# EAGLE design gridsEX (EAGLE 6.6.0)
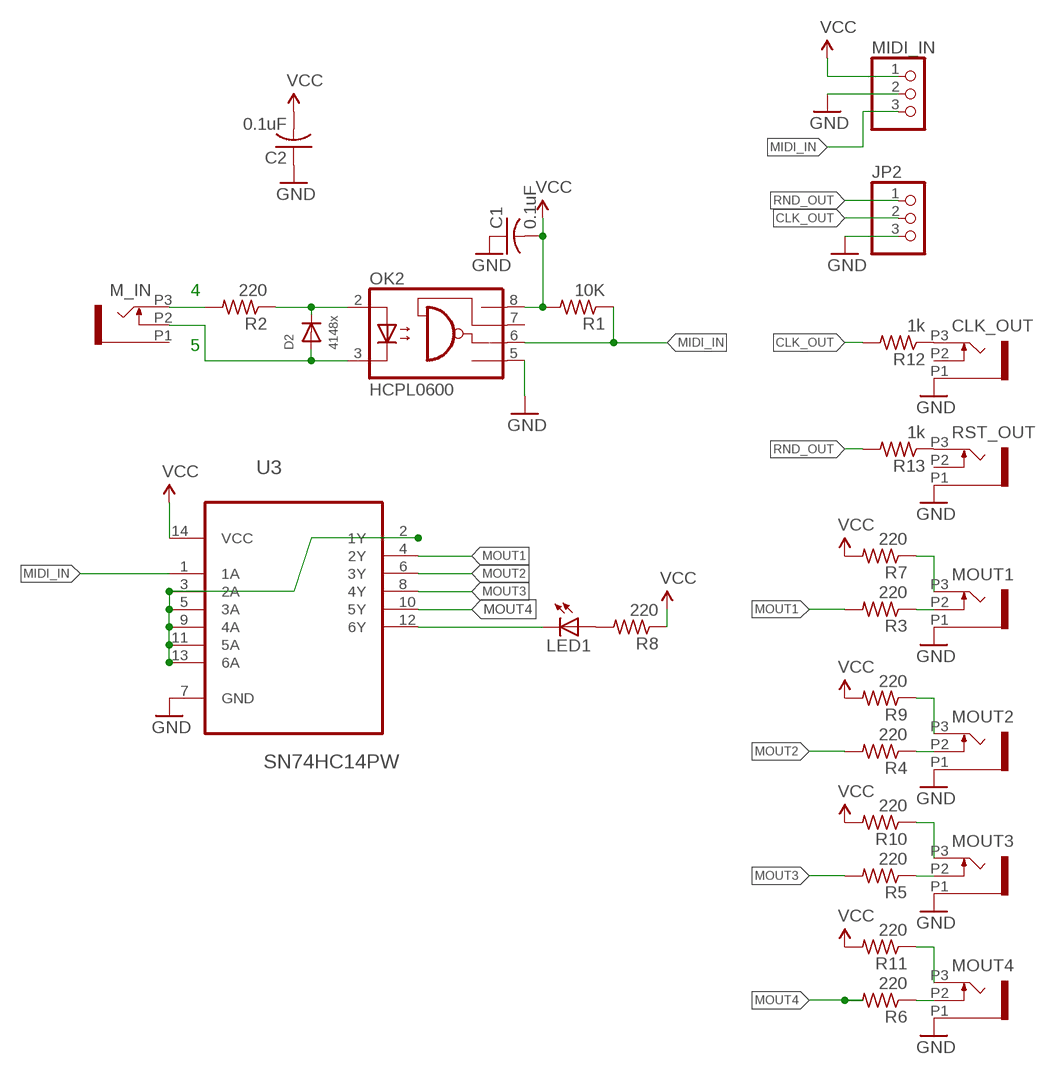
[diagram p0: schematic, sheet 1]

## Parts
C1  0.1uF  RCL_C-USC0603K  [RCL_C0603K]
C2  0.1uF  RCL_C-USC0603K  [RCL_C0603K]
CLK_OUT  PJ301_GUI6  [OG-PJ301_VARIATIONS_WQP_PJ_301M6]
D2  4148x  DIODE_SOD-123  [SOD-123]
JP2  PINHD-1X3  [1X03]
LED1  LED3MM  [LED3MM]
M_IN  PJ301_GUI6  [OG-PJ301_VARIATIONS_WQP_PJ_301M6]
MIDI_IN  PINHD-1X3  [1X03]
MOUT1  PJ301_GUI6  [OG-PJ301_VARIATIONS_WQP_PJ_301M6]
MOUT2  PJ301_GUI6  [OG-PJ301_VARIATIONS_WQP_PJ_301M6]
MOUT3  PJ301_GUI6  [OG-PJ301_VARIATIONS_WQP_PJ_301M6]
MOUT4  PJ301_GUI6  [OG-PJ301_VARIATIONS_WQP_PJ_301M6]
OK2  HCPL0600  [SOIC08]
R1  10K  RCL_R-US_R0603  [RCL_R0603]
R2  220  RCL_R-US_R0603  [RCL_R0603]
R3  220  RCL_R-US_R0603  [RCL_R0603]
R4  220  RCL_R-US_R0603  [RCL_R0603]
R5  220  RCL_R-US_R0603  [RCL_R0603]
R6  220  RCL_R-US_R0603  [RCL_R0603]
R7  220  RCL_R-US_R0603  [RCL_R0603]
R8  220  RCL_R-US_R0603  [RCL_R0603]
R9  220  RCL_R-US_R0603  [RCL_R0603]
R10  220  RCL_R-US_R0603  [RCL_R0603]
R11  220  RCL_R-US_R0603  [RCL_R0603]
R12  1k  RCL_R-US_R0603  [RCL_R0603]
R13  1k  RCL_R-US_R0603  [RCL_R0603]
RST_OUT  PJ301_GUI6  [OG-PJ301_VARIATIONS_WQP_PJ_301M6]
U3  SN74HC14PW  [SOP65P640X120-14N]

## Nets
CLK_OUT: JP2.2 R12.2
GND: C1.1 C2.1 CLK_OUT.P1 JP2.3 MIDI_IN.2 MOUT1.P1 MOUT2.P1 MOUT3.P1 MOUT4.P1 OK2.5(GND) RST_OUT.P1 U3.7(GND)
MIDI_IN: MIDI_IN.3 OK2.6(VO) R1.1 U3.1(1A)
MOUT1: R3.2 U3.4(2Y)
MOUT2: R4.2 U3.6(3Y)
MOUT3: R5.2 U3.8(4Y)
MOUT4: R6.2 U3.10(5Y)
N$1: LED1.K(C) U3.12(6Y)
N$2: D2.C OK2.2(A) R2.1
N$3: M_IN.P3 R2.2
N$4: D2.A M_IN.P2 OK2.3(C)
N$5: LED1.A R8.2
N$6: U3.2(1Y) U3.3(2A) U3.5(3A) U3.9(4A) U3.11(5A) U3.13(6A)
N$7: MOUT1.P2 R3.1
N$8: MOUT1.P3 R7.1
N$9: MOUT2.P3 R9.1
N$10: MOUT3.P3 R10.1
N$11: MOUT4.P3 R11.1
N$12: MOUT2.P2 R4.1
N$13: MOUT3.P2 R5.1
N$14: MOUT4.P2 R6.1
N$15: CLK_OUT.P3 R12.1
N$16: R13.1 RST_OUT.P3
RND_OUT: JP2.1 R13.2
VCC: C1.2 C2.2 MIDI_IN.1 OK2.8(VCC) R1.2 R7.2 R8.1 R9.2 R10.2 R11.2 U3.14(VCC)
Unconnected: CLK_OUT.P2 M_IN.P1 OK2.7(VE) RST_OUT.P2

## Notes on the sheet
- 4
- 5

## Library data of the parts
C1 C2 = ioboard:RCL_C-US: CAPACITOR, American symbol
CLK_OUT M_IN MOUT1-MOUT4 RST_OUT = MILibuTides5:PJ301_GUI
D2 = OldModernDeviceBackup:DIODE: Diode SMADIODE - SMA Surface Mount Package 20V 1A Schottky Diode Digikey: 641-1014-6-ND DO-1N4148 - Through Hole Small Current Diode SOD-123 20V 1 A (.5mV Vf) Schottky Diode - Digikey: MBRX120TPMSCT-ND SOD-323 10V 570mA (.38mV Vf, 3ns) Schottky Diode - Digikey: ZLLS410CT-ND SOD-523 30V 30mA Schottky Diode (RB751S-40TE61) - Digikey: RB751S-40TE61CT-ND SOT23-R/W - SOT23 Package (R = Solder Paste/Reflow Ovens, W = Hand-Soldering) BAT54Film 40V 300mA - Digikey: 497-7162-1-ND DO-214AC DO-214AC 400V 1A Fast Recovery - Digikey: RS1GFSCT-ND MELF-34 4148 style diode - Digikey:FDLL4148CT-ND
JP2 MIDI_IN = pinhead:PINHD-1X3: PIN HEADER
LED1 = led:LED: LED OSRAM: - CHIPLED LG R971, LG N971, LY N971, LG Q971, LY Q971, LO R971, LY R971 LH N974, LH R974 LS Q976, LO Q976, LY Q976 LO Q996 - Hyper CHIPLED LW Q18S LB Q993, LB Q99A, LB R99A - SideLED LS A670, LO A670, LY A670, LG A670, LP A670 LB A673, LV A673, LT A673, LW A673 LH A674 LY A675 LS A676, LA A676, LO A676, LY A676, LW A676 LS A679, LY A679, LG A679 - Hyper Micro SIDELED® LS Y876, LA Y876, LO Y876, LY Y876 LT Y87S - SmartLED LW L88C, LW L88S LB L89C, LB L89S, LG L890 LS L89K, LO L89K, LY L89K LS L896, LA L896, LO L896, LY L896 - TOPLED LS T670, LO T670, LY T670, LG T670, LP T670 LSG T670, LSP T670, LSY T670, LOP T670, LYG T670 LG T671, LOG T671, LSG T671 LB T673, LV T673, LT T673, LW T673 LH T674 LS T676, LA T676, LO T676, LY T676, LB T676, LH T676, LSB T676, LW T676 LB T67C, LV T67C, LT T67C, LS T67K, LO T67K, LY T67K, LW E67C LS E67B, LA E67B, LO E67B, LY E67B, LB E67C, LV E67C, LT E67C LW T67C LS T679, LY T679, LG T679 LS T770, LO T770, LY T770, LG T770, LP T770 LB T773, LV T773, LT T773, LW T773 LH T774 LS E675, LA E675, LY E675, LS T675 LS T776, LA T776, LO T776, LY T776, LB T776 LHGB T686 LT T68C, LB T68C - Hyper Mini TOPLED® LB M676 - Mini TOPLED Santana® LG M470 LS M47K, LO M47K, LY M47K Source: http://www.osram.convergy.de LUXEON: - LUMILED® LXK2-PW12-R00, LXK2-PW12-S00, LXK2-PW14-U00, LXK2-PW14-V00 LXK2-PM12-R00, LXK2-PM12-S00, LXK2-PM14-U00 LXK2-PE12-Q00, LXK2-PE12-R00, LXK2-PE12-S00, LXK2-PE14-T00, LXK2-PE14-U00 LXK2-PB12-K00, LXK2-PB12-L00, LXK2-PB12-M00, LXK2-PB14-N00, LXK2-PB14-P00, LXK2-PB14-Q00 LXK2-PR12-L00, LXK2-PR12-M00, LXK2-PR14-Q00, LXK2-PR14-R00 LXK2-PD12-Q00, LXK2-PD12-R00, LXK2-PD12-S00 LXK2-PH12-R00, LXK2-PH12-S00 LXK2-PL12-P00, LXK2-PL12-Q00, LXK2-PL12-R00 Source: www.luxeon.com KINGBRIGHT: KA-3528ASYC Source: www.kingbright.com
OK2 = optocoupler-2:HCPL0600: HEWLETT PACKARD OPTO COUPLER
R1-R13 = warps_v30:RCL_R-US_: RESISTOR, American symbol
U3 = Raph's Lib:SN74HC14PW: HEX SCHMITT-TRIGGER INVERTERS; MPN: SN74HC14PW; OC_FARNELL: 9591133; OC_NEWARK: 02H5414; PACKAGE: TSSOP-14; SUPPLIER: Texas Instruments

## Board
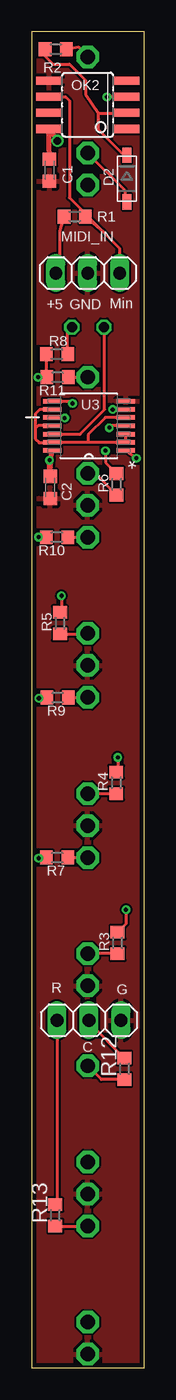
[diagram p1: board, top side]
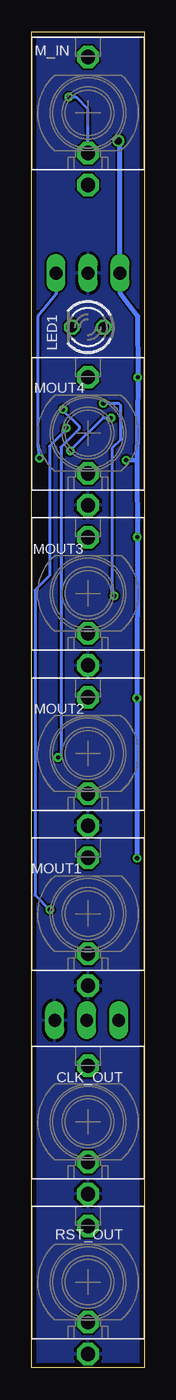
[diagram p2: board, bottom side, seen from below]

Size 8.97 x 105.97 mm. Coordinates in mm from the lower left corner, seen from the top.
Outline: 0,105.97 0,0 8.97,0 8.97,105.97 0,105.97
Copper layers (1*16): Top 0.0356mm / dielectric 1.5011mm / Bottom 0.0356mm
Design rules "LaenPCBOrder": minimum track width 6mil, minimum drill 13mil, track to track 6mil, track to pad 6mil, pad to pad 6mil, via to via 6mil, smd to smd 6mil, copper to edge 15mil, drill to drill 6mil, minimum pad ring 7mil, minimum via ring 7mil, stop-mask expansion 3mil, vias tented up to drill 0mil, thermal gap 10mil

### Footprints (pad centres in the part's own frame; a part is rotated, then mirrored left to right if it is on the bottom)
RCL_C0603K = smd 1.05 x 1.08: 1 -0.875,0; 2 0.875,0
OG-PJ301_VARIATIONS_WQP_PJ_301M6 = drill 1.143 pad 1.778 octagon: P1 0,-5.715; P2 0,-3.175; P3 0,4.445
SOD-123 = smd 1.2 x 0.7: A 1.85,0; C -1.85,0
1X03 = drill 1.016 long: 1 -2.54,0; 2 0,0; 3 2.54,0
LED3MM = drill 0.813 octagon: A -1.27,0; K 1.27,0
SOIC08 = smd 0.66 x 2.032: 1 -1.905,-3.073; 2 -0.635,-3.073; 3 0.635,-3.073; 4 1.905,-3.073; 5 1.905,3.073; 6 0.635,3.073; 7 -0.635,3.073; 8 -1.905,3.073
RCL_R0603 = smd 1 x 1.1: 1 -0.85,0; 2 0.85,0
SOP65P640X120-14N = smd 1.473 x 0.356: 1 -2.921,1.956; 2 -2.921,1.295; 3 -2.921,0.66; 4 -2.921,0; 5 -2.921,-0.66; 6 -2.921,-1.295; 7 -2.921,-1.956; 8 2.921,-1.956; 9 2.921,-1.295; 10 2.921,-0.66; 11 2.921,0; 12 2.921,0.66; 13 2.921,1.295; 14 2.921,1.956

### Placement (x,y rotation side)
C1  1.44,94.97 90 top
C2  1.49,69.82 90 top
CLK_OUT  4.47,19.51 0 bottom
D2  7.58,94.31 270 top
JP2  4.57,27.57 0 top
LED1  4.49,82.53 180 bottom
M_IN  4.47,99.52 0 bottom
MIDI_IN  4.47,86.82 0 top
MOUT1  4.47,36.02 0 bottom
MOUT2  4.47,48.72 0 bottom
MOUT3  4.47,61.42 0 bottom
MOUT4  4.47,74.12 0 bottom
OK2  4.47,100.16 90 top
R1  3.44,91.3 180 top
R2  1.94,104.57 0 top
R3  6.84,33.7 90 top
R4  6.74,46.4 90 top
R5  2.27,59.06 90 top
R6  6.76,70.07 90 top
R7  2.05,40.47 180 top
R8  2.03,80.38 0 top
R9  2.08,53.15 180 top
R10  2.03,65.87 180 top
R11  2.08,78.56 180 top
R12  7.39,23.72 90 top
R13  1.89,12.1 90 top
RST_OUT  4.47,6.81 0 bottom
U3  4.57,74.71 180 top

### Tracks (layer width: path | path; a pad name or v marks a point on that pad's centre or on a via)
CLK_OUT
  Top 0.254: JP2.2 4.57,27.39 R12.2
GND
  pour Top: -1.88,-3.35 -1.88,109.68 12.09,109.68 12.09,-3.35
  pour Bottom: -1.88,107.14 10.82,107.14 10.82,-3.35 -1.88,-3.35
MIDI_IN  (via drill 0.33)
  Top 0.254: OK2.6 2.71,100.8 3.02,100.5 3.02,92.79 5.72,90.08 | 5.72,90.08 6.99,88.81 6.99,86.85 MIDI_IN.3 | v8.34,72.14 U3.1 | R1.1 5.72,90.08
  Bottom 0.254: MIDI_IN.3 7.01,85.14 8.47,83.36 8.47,73.18 v8.34,72.14
MOUT1  (via drill 0.33)
  Top 0.254: U3.4 6.34,74.71 v6.19,74.55 | v7.52,36.34 7.52,35.23 R3.2
  Bottom 0.254: v6.19,74.55 6.19,74.43 7.53,73.09 7.53,62.82 8.68,61.68 8.68,37.5 v7.52,36.34
MOUT2  (via drill 0.33)
  Top 0.254: U3.6 6.61,76 v6.45,76.01 | v6.86,48.41 6.86,47.37 R4.2
  Bottom 0.254: v6.45,76.01 6.53,76.01 5.19,74.67 5.19,74.46 6.63,73.01 6.63,48.64 v6.86,48.41
MOUT3  (via drill 0.33)
  Top 0.254: U3.8 3.09,76.66 v3.26,76.49 | v2.39,61.23 2.39,60.03 R5.2
  Bottom 0.254: v3.26,76.49 2.05,76.49 1.91,76.35 1.91,73.59 2.56,72.94 2.56,61.4 v2.39,61.23
MOUT4  (via drill 0.33)
  Top 0.254: U3.10 2.61,75.37 v2.64,75.33 | v5.88,72.73 5.88,71.8 R6.2
  Bottom 0.254: v2.64,75.33 3.3,75.33 v5.88,72.73
N$1
  Top 0.254: U3.12 3.86,74.05 5.81,75.99 5.81,82.48 LED1.K
N$2
  Top 0.254: D2.C 7.36,96.16 5.34,98.17 5.34,99.02 5.34,99.5 | 5.34,99.5 7.51,99.5 OK2.2 | R2.1 0.68,104.42 1.71,103.4 3.02,103.4 4.31,102.1 4.31,101.01 5.34,99.5
N$3
  Top 0.254: R2.2 3.74,104.75 M_IN.P3
N$4  (via drill 0.33)
  Top 0.254: M_IN.P2 7.42,93.39 7.42,92.62 D2.A | OK2.3 6.02,100.8 v6,100.79
  Bottom 0.254: v6,100.79 5.75,100.79 5.74,100.79 5.44,100.79 4.52,99.87 4.52,96.39 M_IN.P2
N$5
  Top 0.254: R8.2 2.88,82.19 LED1.A
N$6
  Top 0.254: 4.5,73.41 U3.13 1.61,73.37 0.61,73.37 0.31,73.66 0.31,74.49 | 4.5,73.41 U3.2 U3.3 | U3.9 0.67,76 0.31,75.64 0.31,74.49 | U3.11 0.53,74.71 0.31,74.49 | U3.5 5.87,75.37 4.5,74 4.5,73.41
N$7
  Top 0.254: R3.1 MOUT1.P2
N$8
  Top 0.254: R7.1 MOUT1.P3
N$9
  Top 0.254: R9.1 4.46,53.15 MOUT2.P3
N$10
  Top 0.254: R10.1 MOUT3.P3
N$11
  Top 0.254: R11.1 MOUT4.P3
N$12
  Top 0.254: MOUT2.P2 R4.1
N$13
  Top 0.254: R5.1 4.43,58.21 MOUT3.P2
N$14
  Top 0.254: MOUT4.P2 5.03,70.95 R6.1
N$15
  Top 0.254: R12.1 5.57,22.87 CLK_OUT.P3
N$16
  Top 0.254: R13.1 RST_OUT.P3
RND_OUT
  Top 0.254: JP2.1 2.03,13.09 R13.2
VCC  (via drill 0.33, 0.6)
  Top 0.254: v0.52,78.56 0.59,78.56 R11.2 1.23,80.34 R8.1 | R10.2 0.59,65.88 v0.56,65.88 | R9.2 0.76,53.2 v0.59,53.11 | R7.2 1.45,40.5 v0.57,40.43 | MIDI_IN.1 1.93,87.43 2.3,87.73 2.27,90.15 R1.2
  Top 0.406: C1.2 1.4,97.07 1.4,98.25 | 1.4,98.25 OK2.8 | v2.07,97.31 1.4,98.25 | U3.14 1.53,71.94 C2.2 1.42,71.93 v1.44,71.98
  Bottom 0.406: v2.07,97.31 1.93,96.98 MIDI_IN.1 1.93,85.24 0.54,83.41 v0.52,78.56 0.58,71.45 | 0.58,71.45 v0.56,65.88 v0.59,53.11 v0.57,40.43 | v1.44,71.98 0.57,72.02 0.58,71.45

### Text on the board
tNames: +5 | GND | Min | R | G | C